# Altium schematic sheet clock_control.SchDoc
size A4
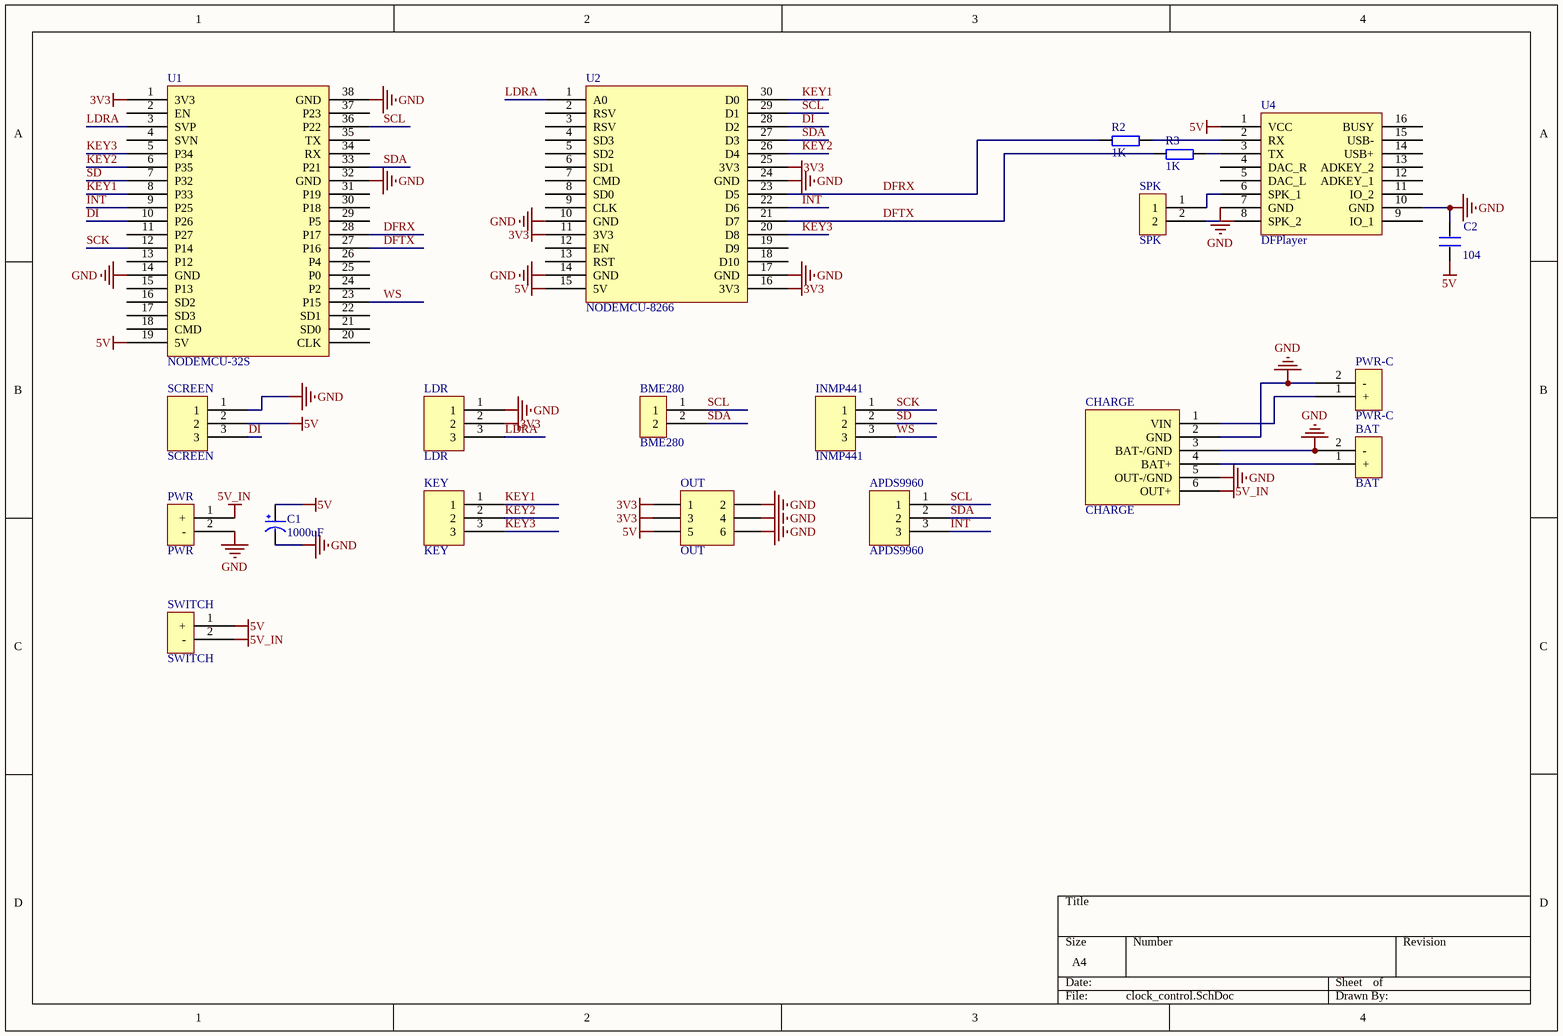
[diagram p0: clock_control.SchDoc]

## Parts
APDS9960  APDS9960  [HEADER3-P]
BAT  BAT  [HEADER2-P]
BME280  BME280  [HEADER2-P]
C1  1000uF  [C0812]
C2  104  [0603P]
CHARGE  CHARGE  [CHARGE]
INMP441  INMP441  [HEADER3-P]
KEY  KEY  [HEADER3-P]
LDR  LDR  [HEADER3-P]
OUT  OUT  [HDR2X3]
PWR  PWR  [HEADER2-P]
PWR-C  PWR-C  [HEADER2-P]
R2  1K  [0603P]
R3  1K  [0603P]
SCREEN  SCREEN  [HEADER3-P]
SPK  SPK  [HEADER2-P]
SWITCH  SWITCH  [HEADER2-P]
U1  NODEMCU-32S  [NODEMCU-32S-2P]
U2  NODEMCU-8266  [NODEMCU-8266-2P]
U4  DFPlayer  [DFPlayer]

## Nets
3V3: LDR.2 OUT.1 OUT.3 U1.1(3V3) U2.11(3V3) U2.16(3V3) U2.25(3V3)
5V: C1.1(VCC) C2.1 OUT.5 SCREEN.2 SWITCH.1(+) U1.19(5V) U2.15(5V) U4.1(VCC)
5V_IN: CHARGE.6(OUT+) PWR.1(+) SWITCH.2(-)
GND: BAT.2(-) C1.2(GND) C2.2 CHARGE.2(GND) CHARGE.3(BAT-/GND) CHARGE.5(OUT-/GND) LDR.1 OUT.2 OUT.4 OUT.6 PWR.2(-) PWR-C.2(-) SCREEN.1 U1.14(GND) U1.32(GND) U1.38(GND) U2.10(GND) U2.14(GND) U2.17(GND) U2.24(GND) U4.7(GND) U4.10(GND)
DFRX: R2.1 U1.28(P17) U2.23(D5)
DFTX: R3.1 U1.27(P16) U2.21(D7)
DI: SCREEN.3 U1.10(P26) U2.28(D2)
INT: APDS9960.3 U1.9(P25) U2.22(D6)
KEY1: KEY.1 U1.8(P33) U2.30(D0)
KEY2: KEY.2 U1.6(P35) U2.26(D4)
KEY3: KEY.3 U1.5(P34) U2.20(D8)
LDRA: LDR.3 U1.3(SVP) U2.1(A0)
SCK: INMP441.1 U1.12(P14)
SCL: APDS9960.1 BME280.1 U1.36(P22) U2.29(D1)
SD: INMP441.2 U1.7(P32)
SDA: APDS9960.2 BME280.2 U1.33(P21) U2.27(D3)
WS: INMP441.3 U1.23(P15)
NetBAT_1: BAT.1(+) CHARGE.4(BAT+)
NetCHARGE_1: CHARGE.1(VIN) PWR-C.1(+)
NetR2_2: R2.2 U4.2(RX)
NetR3_2: R3.2 U4.3(TX)
NetSPK_1: SPK.1 U4.6(SPK_1)
NetSPK_2: SPK.2 U4.8(SPK_2)

Not connected (* = marked no-connect by the designer): U1 2(EN) 4(SVN) 11(P27) 13(P12) 15(P13) 16(SD2) 17(SD3) 18(CMD) 20(CLK) 21(SD0) 22(SD1) 24(P2) 25(P0) 26(P4) 29(P5) 30(P18) 31(P19) 34(RX) 35(TX) 37(P23); U2 2(RSV) 3(RSV) 4(SD3) 5(SD2) 6(SD1) 7(CMD) 8(SD0) 9(CLK) 12(EN) 13(RST) 18(D10) 19(D9); U4 4(DAC_R) 5(DAC_L) 9(IO_1) 11(IO_2) 12(ADKEY_1) 13(ADKEY_2) 14(USB+) 15(USB-) 16(BUSY)

## Library data of the parts
APDS9960 INMP441 KEY LDR SCREEN = HEADER3
BAT PWR PWR-C SWITCH = HEADER2-PWR
BME280 SPK = HEADER2
C1 = CAP
C2 = C
OUT = Header 3X2: Header, 3-Pin, Dual row; LatestRevisionDate: 17-Jul-2002; LatestRevisionNote: Re-released for DXP Platform.; Publisher: Altium Limited
R2 R3 = R